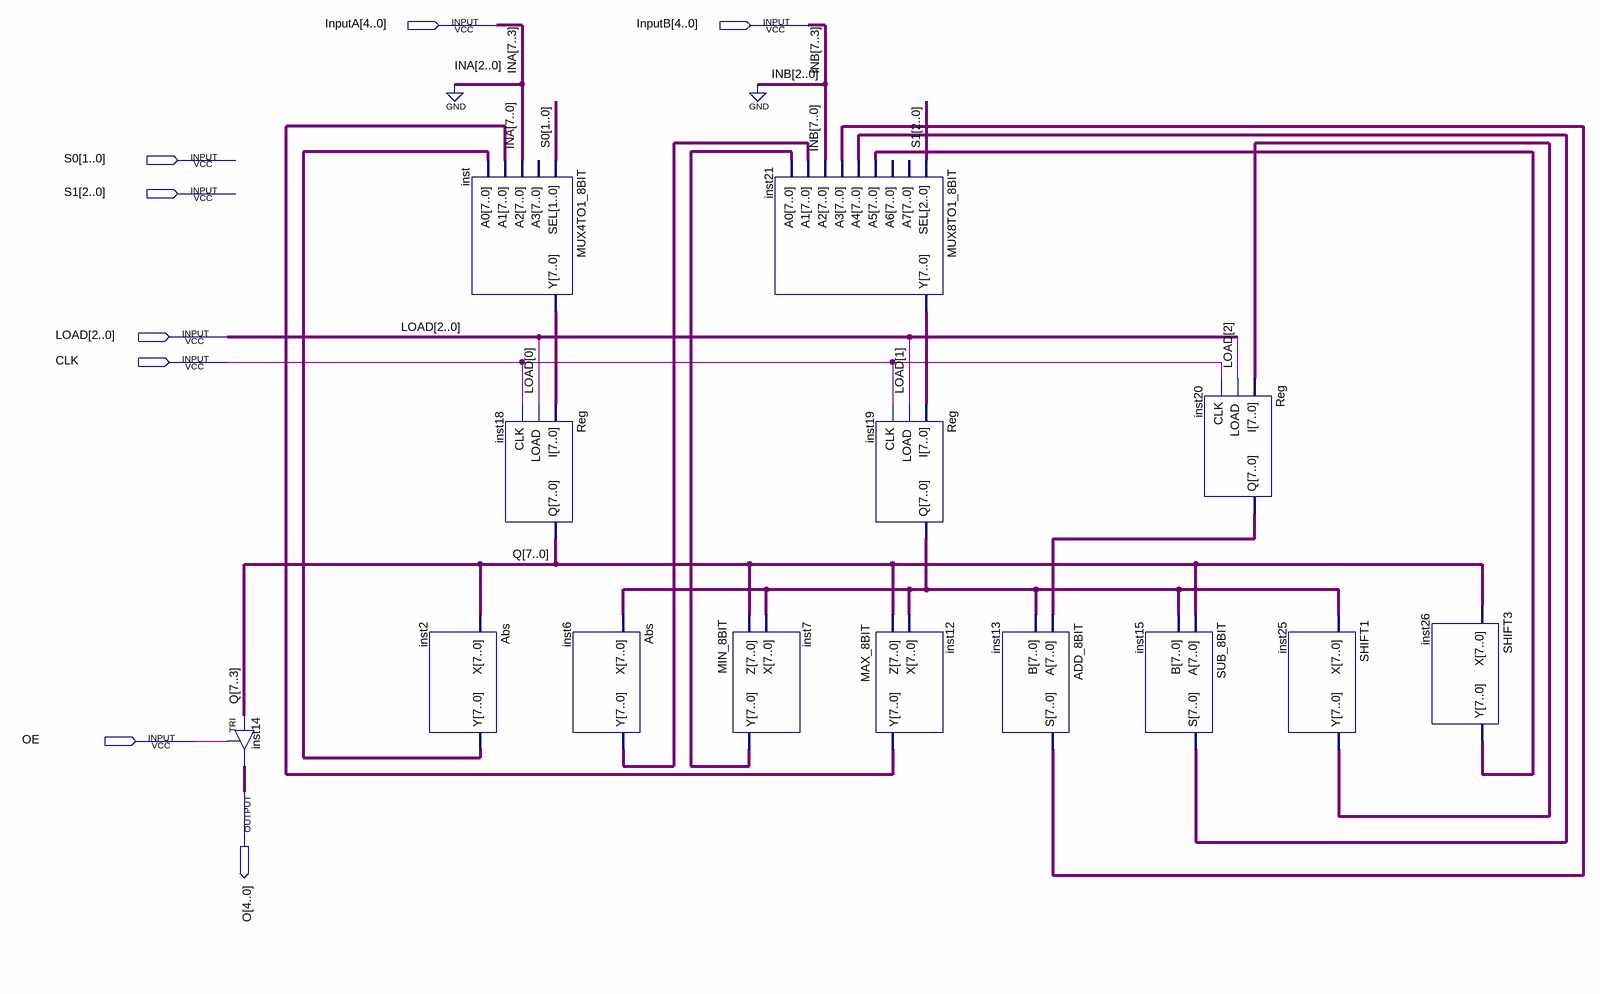
[diagram p0: schematic sheet]
// Quartus schematic datapath1.bdf as structural Verilog: 14 symbols, 8 pins
module datapath1 (
  input  [4:0] InputA,
  input  [4:0] InputB,
  input  [1:0] S0,
  input  [2:0] S1,
  input  [2:0] LOAD,
  input  CLK,
  input  OE,
  output [4:0] O
);

  wire [7:0] inst2_y, inst6_y, inst7_y, inst12_y, inst13_s, inst15_s, inst19_q, inst20_q, inst21_y, inst25_y,
       inst26_y, inst_y, Q;

  TRI inst14[4:0] (.IN(Q[7:3]), .OE(OE), .OUT(O));
  MUX4TO1_8BIT inst (.SEL(S0), .A2({InputA, 3'b000}), .A1(inst12_y), .A0(inst2_y), .Y(inst_y));  // open: A3
  Abs inst2 (.X(Q), .Y(inst2_y));
  Reg inst18 (.I(inst_y), .LOAD(LOAD[0]), .CLK(CLK), .Q(Q));
  Abs inst6 (.X(inst19_q), .Y(inst6_y));
  MIN_8BIT inst7 (.Z(Q), .X(inst19_q), .Y(inst7_y));
  MUX8TO1_8BIT inst21 (
    .SEL(S1), .A5(inst26_y), .A4(inst15_s), .A3(inst13_s), .A2({InputB, 3'b000}), .A1(inst6_y), .A0(inst7_y),
    .Y(inst21_y));  // open: A7, A6
  Reg inst19 (.I(inst21_y), .LOAD(LOAD[1]), .CLK(CLK), .Q(inst19_q));
  MAX_8BIT inst12 (.Z(Q), .X(inst19_q), .Y(inst12_y));
  ADD_8BIT inst13 (.A(inst20_q), .B(inst19_q), .S(inst13_s));
  SUB_8BIT inst15 (.A(Q), .B(inst19_q), .S(inst15_s));
  Reg inst20 (.I(inst25_y), .LOAD(LOAD[2]), .CLK(CLK), .Q(inst20_q));
  SHIFT1 inst25 (.X(inst19_q), .Y(inst25_y));
  SHIFT3 inst26 (.X(Q), .Y(inst26_y));

  // Other names for the same wires on the sheet: INA[7:3] = InputA; INB[7:3] = InputB
endmodule
